# Altium schematic sheet Sheet2.SchDoc
size A; SheetNumber: 1; SheetTotal: 1; SPICEModelCacheIRTRDMGG: <root> / <DocumentId>IRTRDMGG</DocumentId> / </root>
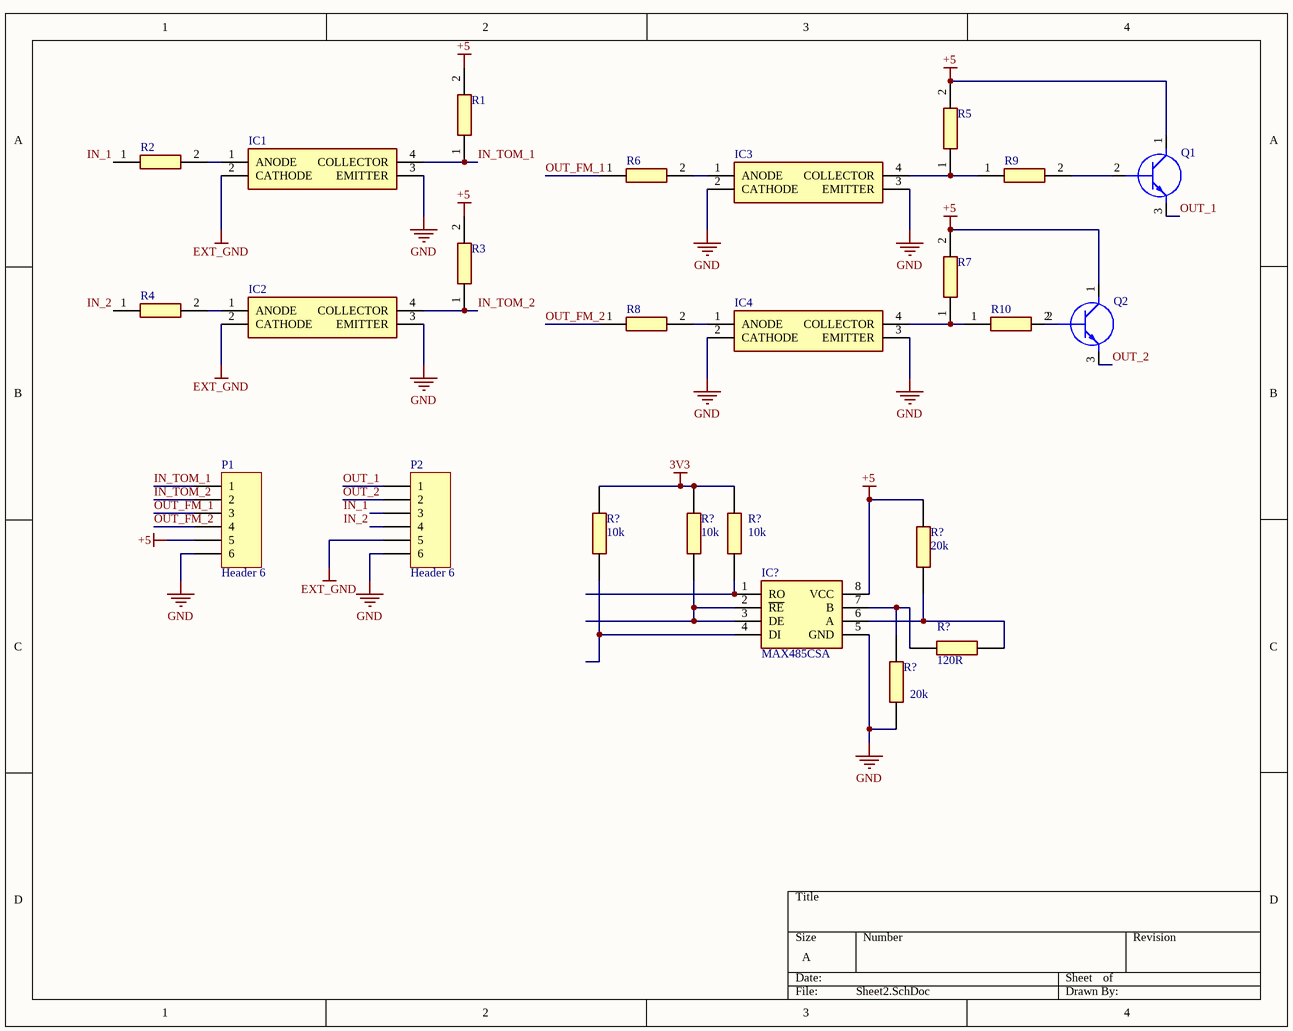
[diagram p0: Sheet2.SchDoc]

## Parts
(Parts that share a designator on the sheet are numbered #1, #2 ... from top to bottom, then left to right.)
IC1  PC817X2NSZ0F  [DIP762W60P254L458H400Q4N]  (value not drawn)
IC2  PC817X2NSZ0F  [DIP762W60P254L458H400Q4N]  (value not drawn)
IC3  PC817X2NSZ0F  [DIP762W60P254L458H400Q4N]  (value not drawn)
IC4  PC817X2NSZ0F  [DIP762W60P254L458H400Q4N]  (value not drawn)
IC?  MAX485CSA  [SOIC127P600X175-8N]
P1  Header 6  [HDR1X6]
P2  Header 6  [HDR1X6]
Q1  BC547BG  [TO-92_(TO-226)]  (value not drawn)
Q2  BC547BG  [TO-92_(TO-226)]  (value not drawn)
R1  RN73C2A10KLTDF  [RESC2012X65N]  (value not drawn)
R2  PCF0805R-1K0BI  [RESC2012X65N]  (value not drawn)
R3  RN73C2A10KLTDF  [RESC2012X65N]  (value not drawn)
R4  PCF0805R-1K0BI  [RESC2012X65N]  (value not drawn)
R5  RN73C2A10KLTDF  [RESC2012X65N]  (value not drawn)
R6  PCF0805R-1K0BI  [RESC2012X65N]  (value not drawn)
R7  RN73C2A10KLTDF  [RESC2012X65N]  (value not drawn)
R8  PCF0805R-1K0BI  [RESC2012X65N]  (value not drawn)
R9  PCF0805R-1K0BI  [RESC2012X65N]  (value not drawn)
R10  PCF0805R-1K0BI  [RESC2012X65N]  (value not drawn)
R?#1  10k  [RESC2012X60N]
R?#2  10k  [RESC2012X60N]
R?#3  10k  [RESC2012X60N]
R?#4  20k  [RESC2012X60N]
R?#5  120R  [RESC2012X60N]
R?#6  20k  [RESC2012X60N]

## Nets
3V3: R?#1.2 R?#2.2 R?#3.2
+5: IC?.8(VCC) P1.5 Q1.1(C) Q2.1(C) R1.2 R3.2 R5.2 R7.2 R?#4.2
EXT_GND: IC1.2(CATHODE) IC2.2(CATHODE) P2.5
GND: IC1.3(EMITTER) IC2.3(EMITTER) IC3.2(CATHODE) IC3.3(EMITTER) IC4.2(CATHODE) IC4.3(EMITTER) IC?.5(GND) P1.6 P2.6 R?#6.1
IN_1: P2.3 R2.1
IN_2: P2.4 R4.1
IN_TOM_1: IC1.4(COLLECTOR) P1.1 R1.1
IN_TOM_2: IC2.4(COLLECTOR) P1.2 R3.1
OUT_1: P2.1 Q1.3(E)
OUT_2: P2.2 Q2.3(E)
OUT_FM_1: P1.3 R6.1
OUT_FM_2: P1.4 R8.1
NetIC1_1: IC1.1(ANODE) R2.2
NetIC2_1: IC2.1(ANODE) R4.2
NetIC3_1: IC3.1(ANODE) R6.2
NetIC3_4: IC3.4(COLLECTOR) R5.1 R9.1
NetIC4_1: IC4.1(ANODE) R8.2
NetIC4_4: IC4.4(COLLECTOR) R7.1 R10.1
NetIC?_1: IC?.1(RO) R?#3.1
NetIC?_2: IC?.2(~{RE}) IC?.3(DE) R?#2.1
NetIC?_4: IC?.4(DI) R?#1.1
NetIC?_6: IC?.6(A) R?#4.1 R?#5.2
NetIC?_7: IC?.7(B) R?#5.1 R?#6.2
NetQ1_2: Q1.2(B) R9.2
NetQ2_2: Q2.2(B) R10.2

## Library data of the parts
IC1-IC4 = PC817X2NSZ0F: Integrated Circuit; Manufacturer_Name: Sharp Microelectronics; Datasheet Link: https://datasheet.datasheetarchive.com/originals/distributors/Datasheets_SAMA/458e45842a103a05998fcebbd6f7366e.pdf; Height: 4mm; Manufacturer_Part_Number: PC817X2NSZ0F; Mouser Part Number: N/A; Mouser Price/Stock: https://www.mouser.co.uk/ProductDetail/Sharp-Microelectronics/PC817X2NSZ0F?qs=6kT3pPPHxnU7uYWM8Yy85A%3D%3D
IC? = MAX485CSA: Integrated Circuit; Manufacturer_Name: Analog Devices; Datasheet Link: https://datasheets.maximintegrated.com/en/ds/MAX1487-MAX491.pdf; Height: 1.75mm; Manufacturer_Part_Number: MAX485CSA; Mouser Part Number: N/A; Mouser Price/Stock: https://www.mouser.co.uk/ProductDetail/Maxim-Integrated/MAX485CSA?qs=LHmEVA8xxfbb%2FSUlm%252BHF3Q%3D%3D
P1 P2 = Header 6: Header, 6-Pin; LatestRevisionDate: 17-Jul-2002; LatestRevisionNote: Re-released for DXP Platform.; Publisher: Altium Limited
Q1 Q2 = BC547BG: Transistor BJT NPN; Manufacturer_Name: onsemi; Datasheet Link: https://www.onsemi.com/download/data-sheet/pdf/BC546-D.PDF; Height: 5.33mm; Manufacturer_Part_Number: BC547BG; Mouser Part Number: N/A; Mouser Price/Stock: http://www.mouser.com/Search/ProductDetail.aspx?qs=NSmgnqlvnz5NIKIycfR5CQ%3d%3d; Arrow Part Number: BC547BG; Arrow Price/Stock: http://www.arrow.com/en/products/bc547bg/on-semiconductor
R1 R3 R5 R7 = RN73C2A10KLTDF: Resistor; Manufacturer_Name: TE Connectivity; Datasheet Link: http://docs-europe.electrocomponents.com/webdocs/1488/0900766b814885e5.pdf; Height: 0.65mm; Manufacturer_Part_Number: RN73C2A10KLTDF; Mouser Part Number: 279-RN73C2A10KLTDF; Mouser Price/Stock: https://www.mouser.co.uk/ProductDetail/TE-Connectivity-Holsworthy/RN73C2A10KLTDF?qs=1Hpg7qxOs69sC8pHBMR1GQ%3D%3D
R2 R4 R6 R8-R10 = PCF0805R-1K0BI: Resistor; Manufacturer_Name: TT Electronics; Datasheet Link: https://componentsearchengine.com/Datasheets/1/PCF0805-13-10KBT1.pdf; Height: 0.65mm; Manufacturer_Part_Number: PCF0805R-1K0BI; Mouser Part Number: 756-PCF0805R1K0BI; Mouser Price/Stock: https://www.mouser.co.uk/ProductDetail/Welwyn-Components-TT-Electronics/PCF0805R-1K0BI?qs=mbEfOQsdCzdnsA0Coprz5g%3D%3D
R?#1-R?#3 = CR0805-FX-1002ELF: Resistor; Manufacturer_Name: Bourns; Datasheet Link: https://www.bourns.com/pdfs/chpreztr.pdf; Height: 0.6mm; Manufacturer_Part_Number: CR0805-FX-1002ELF; Mouser Part Number: 652-CR0805FX-1002ELF; Mouser Price/Stock: https://www.mouser.co.uk/ProductDetail/Bourns/CR0805-FX-1002ELF?qs=tknLyCMIRbPr%252BDD0s0nG9g%3D%3D; Arrow Part Number: CR0805-FX-1002ELF; Arrow Price/Stock: https://www.arrow.com/en/products/cr0805-fx-1002elf/bourns?region=nac
R?#4 R?#6 = CR0805-FX-2002ELF: Resistor; Manufacturer_Name: Bourns; Datasheet Link: https://www.bourns.com/pdfs/chpreztr.pdf; Height: 0.6mm; Manufacturer_Part_Number: CR0805-FX-2002ELF; Mouser Part Number: 652-CR0805FX-2002ELF; Mouser Price/Stock: https://www.mouser.co.uk/ProductDetail/Bourns/CR0805-FX-2002ELF?qs=mEbcl8R%252Bl%252Bv8rqM1zQjjRA%3D%3D; Arrow Part Number: CR0805-FX-2002ELF; Arrow Price/Stock: https://www.arrow.com/en/products/cr0805-fx-2002elf/bourns?region=nac
R?#5 = CR0805-JW-121ELF: Resistor; Manufacturer_Name: Bourns; Datasheet Link: https://www.bourns.com/pdfs/chpreztr.pdf; Height: 0.6mm; Manufacturer_Part_Number: CR0805-JW-121ELF; Mouser Part Number: 652-CR0805JW-121ELF; Mouser Price/Stock: https://www.mouser.co.uk/ProductDetail/Bourns/CR0805-JW-121ELF?qs=wL7NMIHXUPnmcuStpLOKew%3D%3D; Arrow Part Number: CR0805-JW-121ELF; Arrow Price/Stock: https://www.arrow.com/en/products/cr0805-jw-121elf/bourns?region=nac